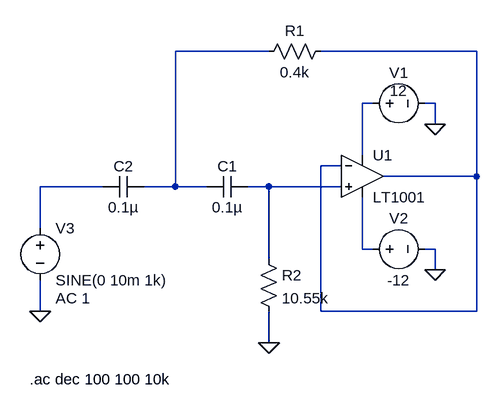
[diagram p0: schematic pasaalto.asc]
pasaalto.asc, the LTspice schematic file:
Version 4
SHEET 1 880 680
WIRE 208 -32 64 -32
WIRE 528 -32 288 -32
WIRE 368 48 352 48
WIRE 464 48 448 48
WIRE 464 80 464 48
WIRE 352 128 352 48
WIRE 320 144 288 144
WIRE 528 160 528 -32
WIRE 528 160 384 160
WIRE -48 176 -144 176
WIRE 64 176 64 -32
WIRE 64 176 16 176
WIRE 112 176 64 176
WIRE 208 176 176 176
WIRE 320 176 208 176
WIRE -144 240 -144 176
WIRE 352 272 352 192
WIRE 368 272 352 272
WIRE 464 272 448 272
WIRE 208 288 208 176
WIRE 464 304 464 272
WIRE -144 368 -144 320
WIRE 288 368 288 144
WIRE 528 368 528 160
WIRE 528 368 288 368
WIRE 208 416 208 368
FLAG 464 80 0
FLAG 464 304 0
FLAG -144 368 0
FLAG 208 416 0
SYMBOL OpAmps\\LT1001 352 96 R0
SYMATTR InstName U1
SYMBOL voltage 352 48 R270
WINDOW 0 32 56 VTop 2
WINDOW 3 4 56 VTop 2
WINDOW 123 0 0 Left 0
WINDOW 39 0 0 Left 0
SYMATTR InstName V1
SYMATTR Value 12
SYMBOL voltage 352 272 R270
WINDOW 0 32 56 VTop 2
WINDOW 3 -32 56 VBottom 2
WINDOW 123 0 0 Left 0
WINDOW 39 0 0 Left 0
SYMATTR InstName V2
SYMATTR Value -12
SYMBOL res 304 -48 R90
WINDOW 0 0 56 VBottom 2
WINDOW 3 32 56 VTop 2
SYMATTR InstName R1
SYMATTR Value 0.4k
SYMBOL cap 176 160 R90
WINDOW 0 0 32 VBottom 2
WINDOW 3 32 32 VTop 2
SYMATTR InstName C1
SYMATTR Value 0.1µ
SYMBOL cap 16 160 R90
WINDOW 0 0 32 VBottom 2
WINDOW 3 32 32 VTop 2
SYMATTR InstName C2
SYMATTR Value 0.1µ
SYMBOL res 192 272 R0
SYMATTR InstName R2
SYMATTR Value 10.55k
SYMBOL voltage -144 224 R0
WINDOW 123 24 124 Left 2
WINDOW 39 0 0 Left 0
SYMATTR Value2 AC 1
SYMATTR InstName V3
SYMATTR Value SINE(0 10m 1k)
TEXT -160 472 Left 2 !.ac dec 100 100 10k

The netlist it stands for:
* pasaalto.asc
XU1 N005 N002 N003 N006 N002 LT1001  ; pins In+ In- V+ V- OUT
V1 N003 0 12
V2 N006 0 -12
R1 N002 N001 0.4k
C1 N005 N001 0.1µ
C2 N001 N004 0.1µ
R2 N005 0 10.55k
V3 N004 0 SINE(0 10m 1k) AC 1
.ac dec 100 100 10k
.lib LTC.lib
.backanno
.end